# EAGLE schematic 5V-RAIL (EAGLE 7.4.0)
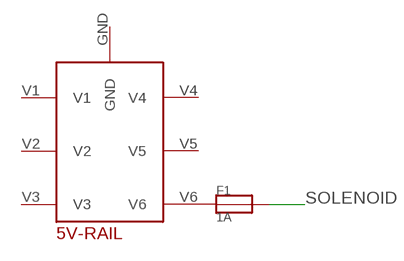
[diagram p0: schematic, sheet 1]

## Parts
5V-RAIL  FUSEBLOCK-6  [FUSEBLOCK-6PT]
F1  1A  FUSE  [FUSE]

## Nets
N$2: 5V-RAIL.V6 F1.P$1
SOLENOID: F1.P$2

## Power pins joined to a net without a drawn wire
GND: 5V-RAIL.GND
V1: 5V-RAIL.V1
V2: 5V-RAIL.V2
V3: 5V-RAIL.V3
V4: 5V-RAIL.V4
V5: 5V-RAIL.V5

## Library data of the parts
5V-RAIL = igvc:FUSEBLOCK-6
F1 = igvc:FUSE